# EAGLE design PRIZMA v1 (EAGLE 6.5.0)

## Sheet 1 of 3
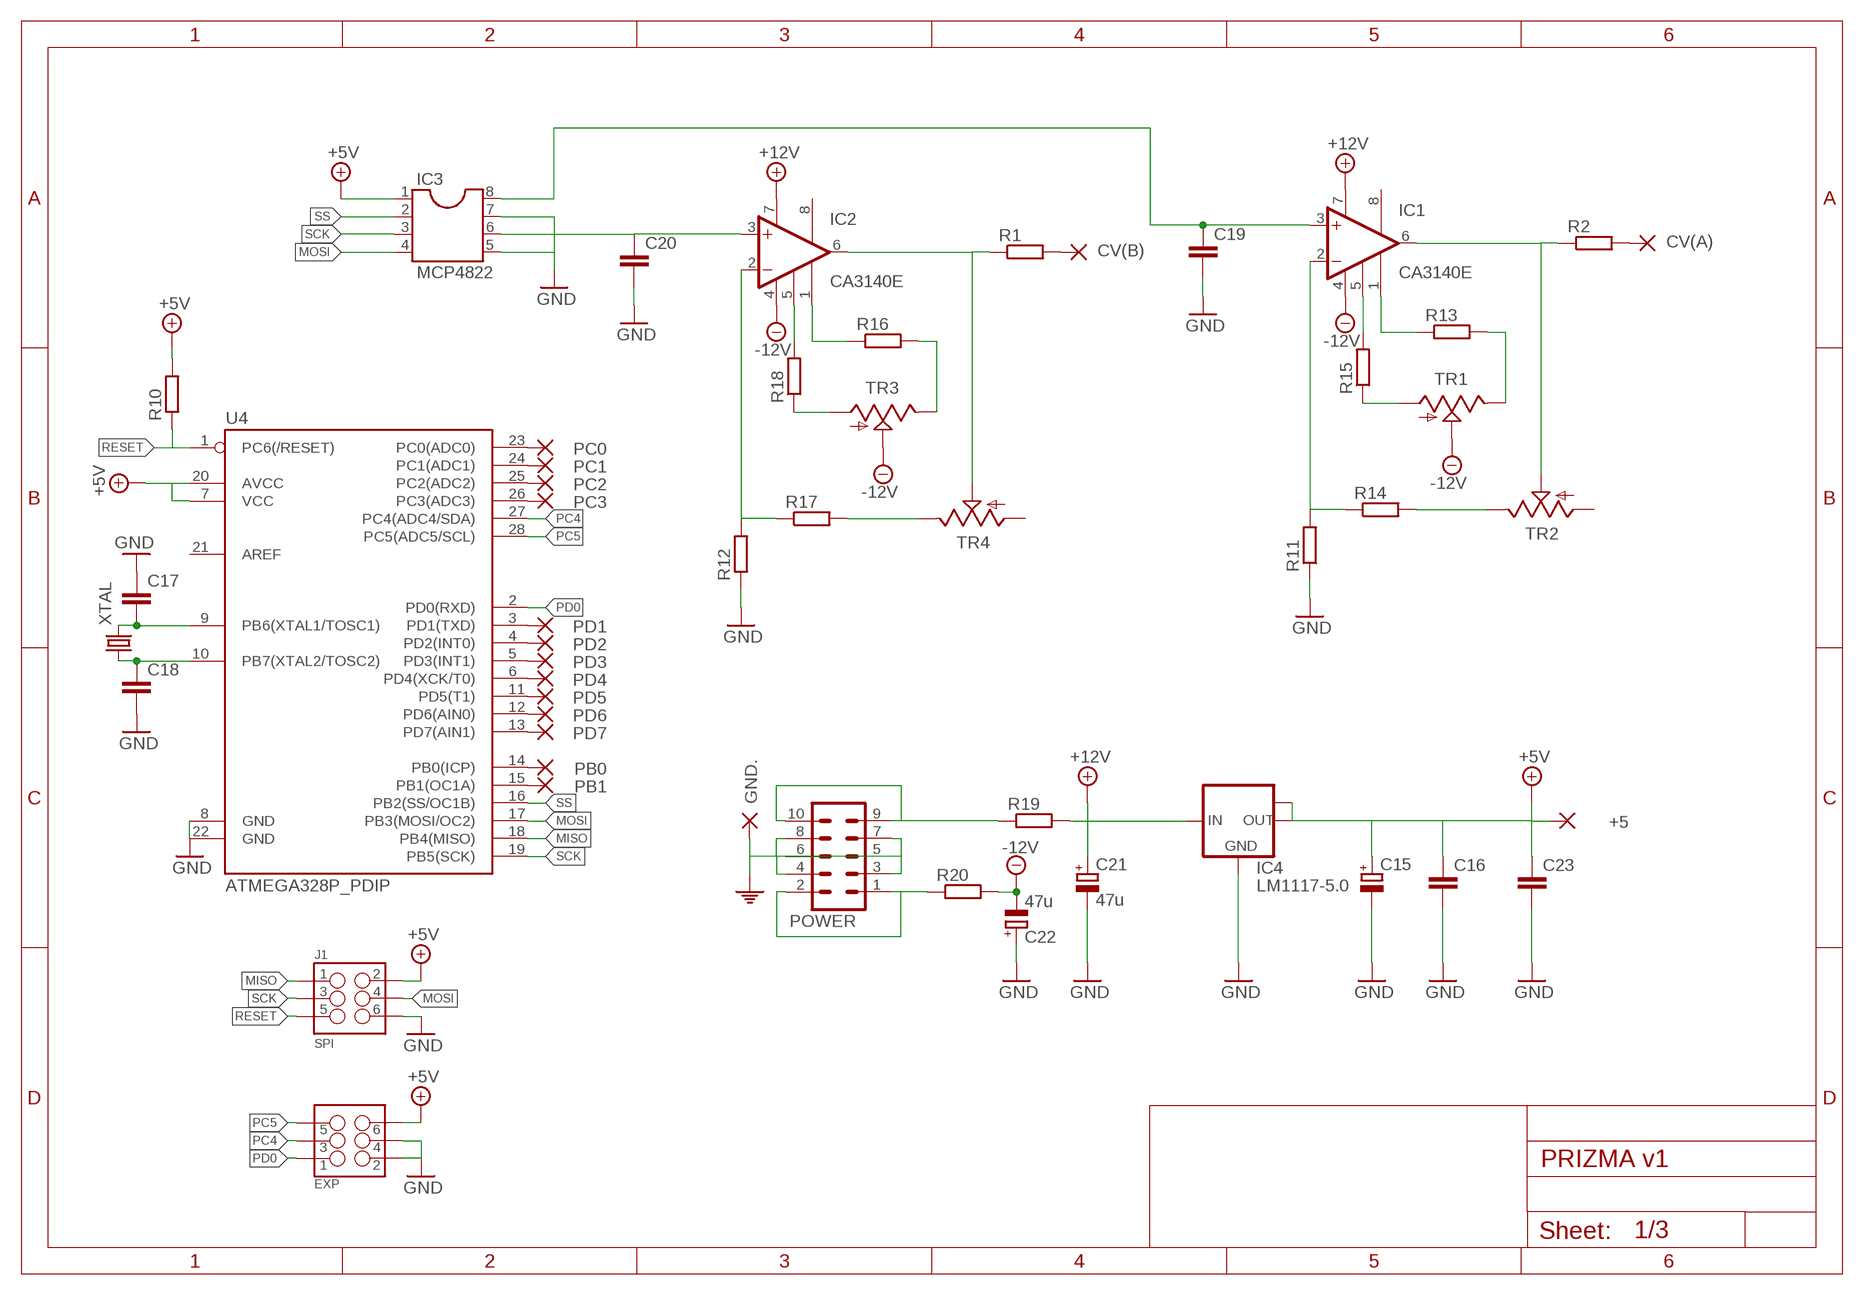
[diagram p0: schematic, sheet 1]

### Parts
+5  2,0/0,9-O  [2,0/0,9-O]
C15  CPOL-EUC  [PANASONIC_C]
C16  C-EUC0603  [C0603]
C17  C-EUC0603  [C0603]
C18  C-EUC0603  [C0603]
C19  C-EUC0603  [C0603]
C20  C-EUC0603  [C0603]
C21  47u  CPOL-EUD  [PANASONIC_D]
C22  47u  CPOL-EUD  [PANASONIC_D]
C23  C-EUC0603  [C0603]
CV(A)  2,0/0,9-O  [2,0/0,9-O]
CV(B)  2,0/0,9-R  [2,0/0,9-R]
EXP  M03X2NO_SILK  [2X3-NS]
GND.  2,0/0,9-O  [2,0/0,9-O]
IC1  CA3140E  OP97P  [DIL08]
IC2  CA3140E  OP97P  [DIL08]
IC3  MCP4822  DIL8  [DIL08]
IC4  LM1117-5.0  LM1117MPX-5.0  [SOT223]
J1  SPI  M03X2NO_SILK  [2X3-NS]
PB0  2,0/0,9-O  [2,0/0,9-O]
PB1  2,0/0,9-O  [2,0/0,9-O]
PC0  2,0/0,9-O  [2,0/0,9-O]
PC1  2,0/0,9-O  [2,0/0,9-O]
PC2  2,0/0,9-O  [2,0/0,9-O]
PC3  2,0/0,9-O  [2,0/0,9-O]
PD1  2,0/0,9-O  [2,0/0,9-O]
PD2  2,0/0,9-O  [2,0/0,9-O]
PD3  2,0/0,9-O  [2,0/0,9-O]
PD4  2,0/0,9-O  [2,0/0,9-O]
PD5  2,0/0,9-O  [2,0/0,9-O]
PD6  2,0/0,9-O  [2,0/0,9-O]
PD7  2,0/0,9-O  [2,0/0,9-O]
POWER  M05X2SHD  [2X5-SHROUDED]
R1  R-EU_R0603  [R0603]
R2  R-EU_R0603  [R0603]
R10  R-EU_R0603  [R0603]
R11  R-EU_R0603  [R0603]
R12  R-EU_R0603  [R0603]
R13  R-EU_R0603  [R0603]
R14  R-EU_R0603  [R0603]
R15  R-EU_R0603  [R0603]
R16  R-EU_R0603  [R0603]
R17  R-EU_R0603  [R0603]
R18  R-EU_R0603  [R0603]
R19  R-EU_R0603  [R0603]
R20  R-EU_R0603  [R0603]
TR1  TRIM_US-RJ9W  [RJ9W]
TR2  TRIM_US-RJ9W  [RJ9W]
TR3  TRIM_US-RJ9W  [RJ9W]
TR4  TRIM_US-RJ9W  [RJ9W]
U4  ATMEGA328P_PDIP  [DIL28-3]
XTAL  CRYSTALSMD  [HC49UP]

### Nets
+5V: +5.1(P) C15.+ C16.1 C23.1 EXP.6 IC3.1 IC4.2(OUT) IC4.TAB(OUT1) J1.2 R10.2 U4.7(VCC) U4.20(AVCC)
+12V: C21.+ IC1.7(V+) IC2.7(V+) IC4.3(IN) R19.2
-12V: C22.- IC1.4(V-) IC2.4(V-) R20.2 TR1.S TR3.S
MISO: J1.1 U4.18(PB4(MISO))
MOSI: IC3.4 J1.4 U4.17(PB3(MOSI/OC2))
N$1: IC1.5(COMP) R15.2
N$2: R15.1 TR1.A
N$3: IC1.1(BAL1) R13.1
N$4: R13.2 TR1.E
N$5: C19.1 IC1.3(+IN) IC3.8
N$6: IC1.2(-IN) R11.2 R14.1
N$7: IC1.6(OUT) R2.1 TR2.S
N$8: R14.2 TR2.E
N$9: IC2.5(COMP) R18.2
N$10: R18.1 TR3.A
N$11: IC2.1(BAL1) R16.1
N$12: R16.2 TR3.E
N$13: C20.1 IC2.3(+IN) IC3.6
N$14: IC2.2(-IN) R12.2 R17.1
N$15: IC2.6(OUT) R1.1 TR4.S
N$16: R17.2 TR4.E
N$23: PD5.1(P) U4.11(PD5(T1))
N$24: PB1.1(P) U4.15(PB1(OC1A))
N$25: C17.2 U4.9(PB6(XTAL1/TOSC1)) XTAL.2
N$26: C18.1 U4.10(PB7(XTAL2/TOSC2)) XTAL.1
N$27: PD4.1(P) U4.6(PD4(XCK/T0))
N$28: PD7.1(P) U4.13(PD7(AIN1))
N$29: PD6.1(P) U4.12(PD6(AIN0))
N$30: PB0.1(P) U4.14(PB0(ICP))
N$31: PD2.1(P) U4.4(PD2(INT0))
N$33: PD3.1(P) U4.5(PD3(INT1))
N$34: POWER.1 POWER.2 R20.1
N$46: PC0.1(P) U4.23(PC0(ADC0))
N$52: PC1.1(P) U4.24(PC1(ADC1))
N$53: PC2.1(P) U4.25(PC2(ADC2))
N$54: PC3.1(P) U4.26(PC3(ADC3))
N$55: POWER.9 POWER.10 R19.1
N$57: PD1.1(P) U4.3(PD1(TXD))
N$60: CV(A).1(P) R2.2
N$61: CV(B).1(P) R1.2
PC4: EXP.3 U4.27(PC4(ADC4/SDA))
PC5: EXP.5 U4.28(PC5(ADC5/SCL))
PD0: EXP.1 U4.2(PD0(RXD))
PE: C15.- C16.2 C17.1 C18.2 C19.2 C20.2 C21.- C22.+ C23.2 EXP.2 EXP.4 GND..1(P) IC3.5 IC3.7 IC4.1(GND) J1.6 POWER.3 POWER.4 POWER.5 POWER.6 POWER.7 POWER.8 R11.1 R12.1 U4.8(GND) U4.22(GND) ; supply symbol labelled GND
RESET: J1.5 R10.1 U4.1(PC6(/RESET))
SCK: IC3.3 J1.3 U4.19(PB5(SCK))
SS: IC3.2 U4.16(PB2(SS/OC1B))
Unconnected: IC1.8(BAL2) IC2.8(BAL2) TR2.A TR4.A U4.21(AREF)

## Sheet 2 of 3
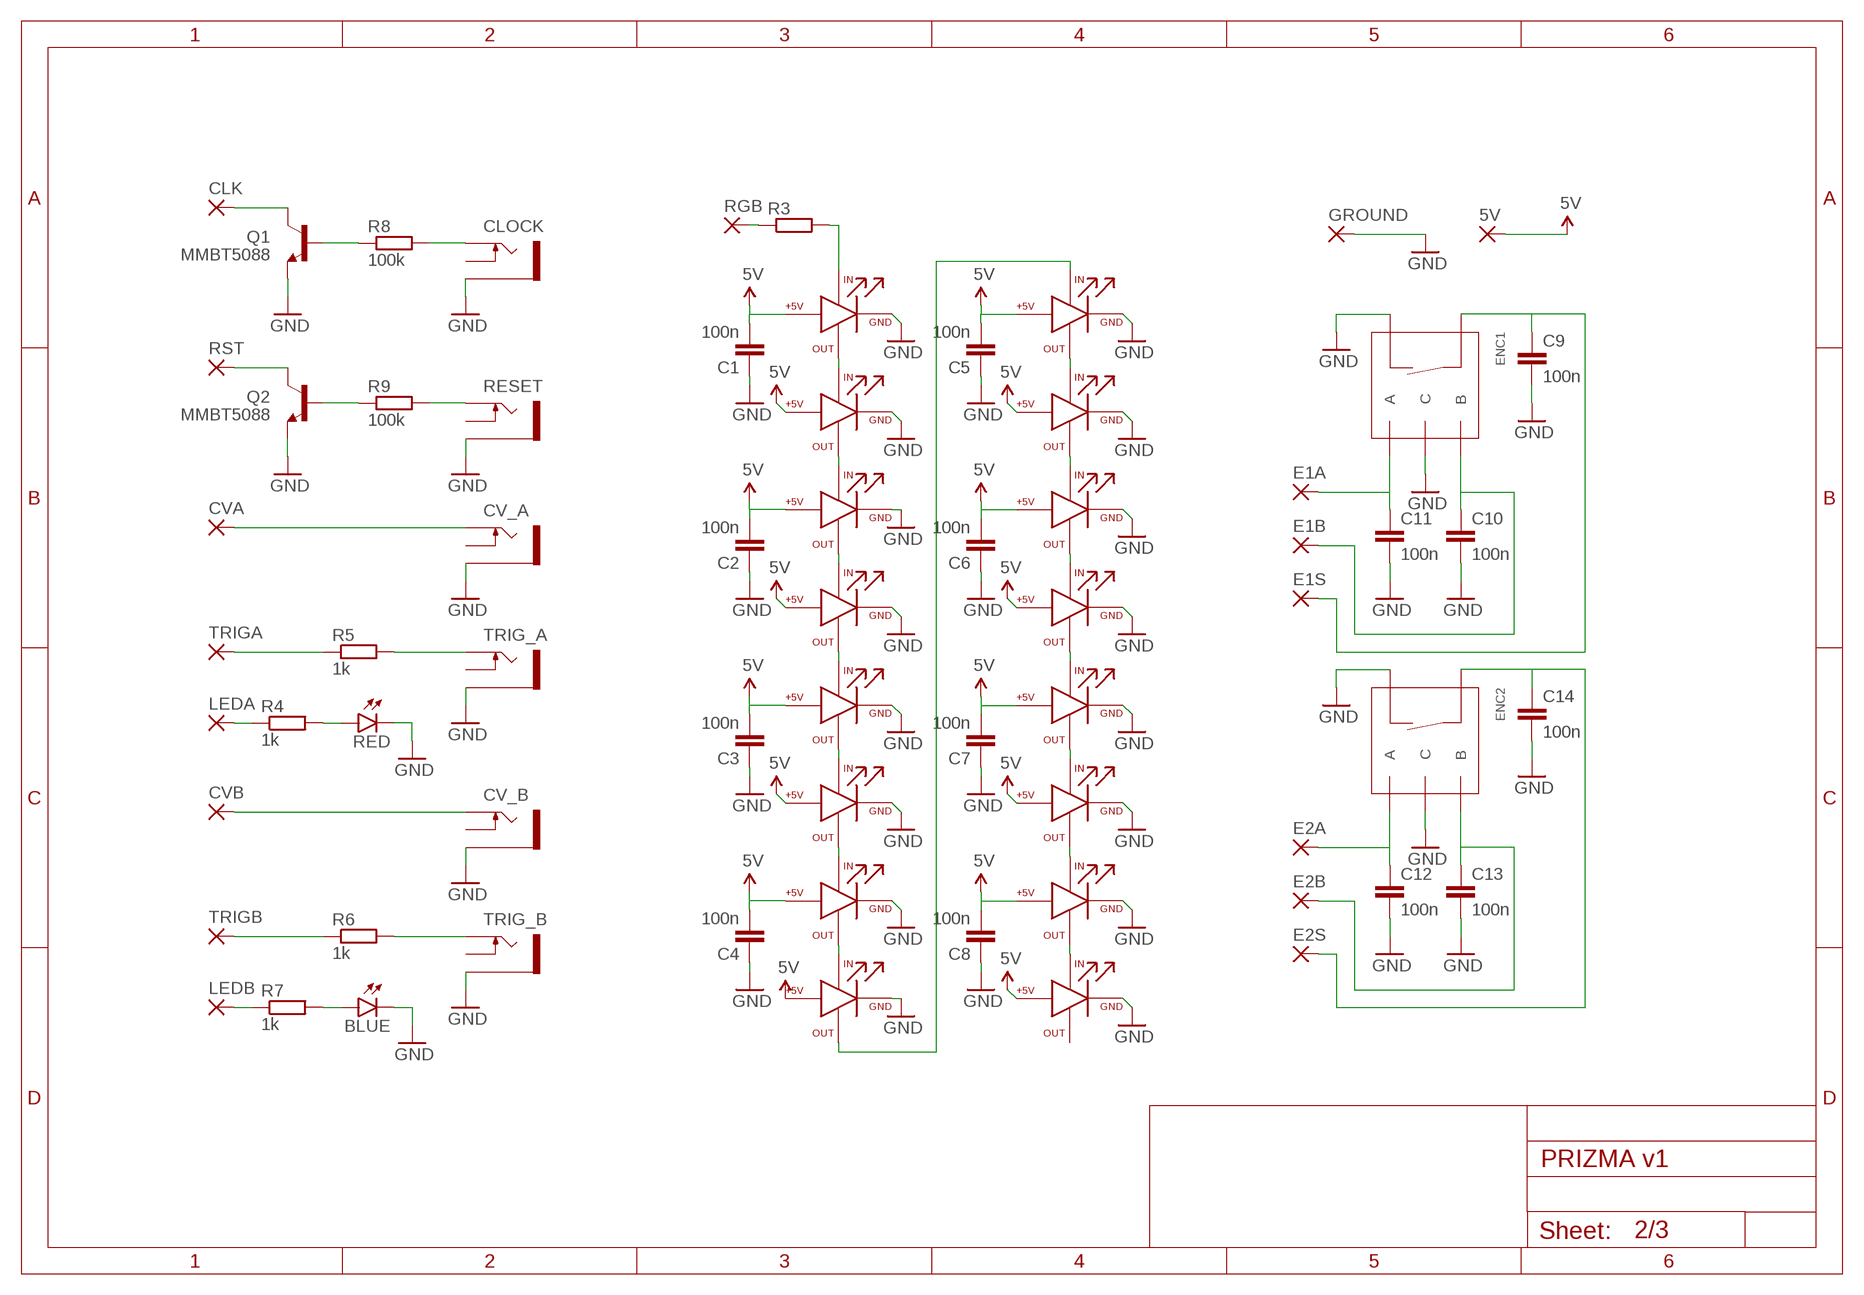
[diagram p1: schematic, sheet 2]

### Parts
5V  2,0/0,9-R  [2,0/0,9-R]
BLUE  LED3MM  [LED3MM]
C1  100n  C-EUC0603  [C0603]
C2  100n  C-EUC0603  [C0603]
C3  100n  C-EUC0603  [C0603]
C4  100n  C-EUC0603  [C0603]
C5  100n  C-EUC0603  [C0603]
C6  100n  C-EUC0603  [C0603]
C7  100n  C-EUC0603  [C0603]
C8  100n  C-EUC0603  [C0603]
C9  100n  C-EUC0603  [C0603]
C10  100n  C-EUC0603  [C0603]
C11  100n  C-EUC0603  [C0603]
C12  100n  C-EUC0603  [C0603]
C13  100n  C-EUC0603  [C0603]
C14  100n  C-EUC0603  [C0603]
CLK  2,0/0,9-O  [2,0/0,9-O]
CLOCK  THONKICONN  [THONKICONN]
CV_A  THONKICONN  [THONKICONN]
CV_B  THONKICONN  [THONKICONN]
CVA  2,0/0,9-R  [2,0/0,9-R]
CVB  2,0/0,9-R  [2,0/0,9-R]
D1  LED-RGB-CA-THRUCLEAR  [LED-RGB-THRU]
D2  LED-RGB-CA-THRUCLEAR  [LED-RGB-THRU]
D3  LED-RGB-CA-THRUCLEAR  [LED-RGB-THRU]
D4  LED-RGB-CA-THRUCLEAR  [LED-RGB-THRU]
D5  LED-RGB-CA-THRUCLEAR  [LED-RGB-THRU]
D6  LED-RGB-CA-THRUCLEAR  [LED-RGB-THRU]
D7  LED-RGB-CA-THRUCLEAR  [LED-RGB-THRU]
D8  LED-RGB-CA-THRUCLEAR  [LED-RGB-THRU]
D13  LED-RGB-CA-THRUCLEAR  [LED-RGB-THRU]
D14  LED-RGB-CA-THRUCLEAR  [LED-RGB-THRU]
D15  LED-RGB-CA-THRUCLEAR  [LED-RGB-THRU]
D19  LED-RGB-CA-THRUCLEAR  [LED-RGB-THRU]
D20  LED-RGB-CA-THRUCLEAR  [LED-RGB-THRU]
D21  LED-RGB-CA-THRUCLEAR  [LED-RGB-THRU]
D22  LED-RGB-CA-THRUCLEAR  [LED-RGB-THRU]
D23  LED-RGB-CA-THRUCLEAR  [LED-RGB-THRU]
E1A  2,0/0,9-O  [2,0/0,9-O]
E1B  2,0/0,9-O  [2,0/0,9-O]
E1S  2,0/0,9-O  [2,0/0,9-O]
E2A  2,0/0,9-O  [2,0/0,9-O]
E2B  2,0/0,9-O  [2,0/0,9-O]
E2S  2,0/0,9-O  [2,0/0,9-O]
ENC1  ROTARTY_ENCODER  [ROTARY_ENC_PLAIN]
ENC2  ROTARTY_ENCODER  [ROTARY_ENC_PLAIN]
GROUND  2,0/0,9-O  [2,0/0,9-O]
LEDA  2,0/0,9-R  [2,0/0,9-R]
LEDB  2,0/0,9-R  [2,0/0,9-R]
Q1  MMBT5088  TRANSISTOR_NPNMMBT5088  [SOT23-3]
Q2  MMBT5088  TRANSISTOR_NPNMMBT5088  [SOT23-3]
R3  R-EU_R0603  [R0603]
R4  1k  R-EU_R0603  [R0603]
R5  1k  R-EU_R0603  [R0603]
R6  1k  R-EU_R0603  [R0603]
R7  1k  R-EU_R0603  [R0603]
R8  100k  R-EU_R0603  [R0603]
R9  100k  R-EU_R0603  [R0603]
RED  LED3MM  [LED3MM]
RESET  THONKICONN  [THONKICONN]
RGB  2,0/0,9-O  [2,0/0,9-O]
RST  2,0/0,9-O  [2,0/0,9-O]
TRIG_A  THONKICONN  [THONKICONN]
TRIG_B  THONKICONN  [THONKICONN]
TRIGA  2,0/0,9-R  [2,0/0,9-R]
TRIGB  2,0/0,9-R  [2,0/0,9-R]

### Nets
5V: 5V.1(P) C1.2 C2.2 C3.2 C4.2 C5.2 C6.2 C7.2 C8.2 D1.2(+5V) D2.2(+5V) D3.2(+5V) D4.2(+5V) D5.2(+5V) D6.2(+5V) D7.2(+5V) D8.2(+5V) D13.2(+5V) D14.2(+5V) D15.2(+5V) D19.2(+5V) D20.2(+5V) D21.2(+5V) D22.2(+5V) D23.2(+5V)
GND: BLUE.K(C) C1.1 C2.1 C3.1 C4.1 C5.1 C6.1 C7.1 C8.1 C9.2 C10.2 C11.2 C12.2 C13.2 C14.2 CLOCK.P$1 CV_A.P$1 CV_B.P$1 D1.3(GND) D2.3(GND) D3.3(GND) D4.3(GND) D5.3(GND) D6.3(GND) D7.3(GND) D8.3(GND) D13.3(GND) D14.3(GND) D15.3(GND) D19.3(GND) D20.3(GND) D21.3(GND) D22.3(GND) D23.3(GND) ENC1.C ENC1.SW- ENC2.C ENC2.SW- GROUND.1(P) Q1.2(E) Q2.2(E) RED.K(C) RESET.P$1 TRIG_A.P$1 TRIG_B.P$1
N$17: C11.1 E1A.1(P) ENC1.A
N$18: C10.1 E1B.1(P) ENC1.B
N$19: C12.1 E2A.1(P) ENC2.A
N$20: C13.1 E2B.1(P) ENC2.B
N$21: C14.1 E2S.1(P) ENC2.SW+
N$22: C9.1 E1S.1(P) ENC1.SW+
N$32: D19.1(DATA_IN) R3.2
N$36: Q1.1(B) R8.1
N$37: Q2.1(B) R9.1
N$38: CLK.1(P) Q1.3(C)
N$39: Q2.3(C) RST.1(P)
N$40: CLOCK.P$3 R8.2
N$41: R9.2 RESET.P$3
N$42: CV_A.P$3 CVA.1(P)
N$43: R5.1 TRIGA.1(P)
N$44: CV_B.P$3 CVB.1(P)
N$45: R5.2 TRIG_A.P$3
N$47: D19.4(DATA_OUT) D20.1(DATA_IN)
N$48: R4.2 RED.A
N$49: BLUE.A R7.2
N$50: LEDB.1(P) R7.1
N$51: LEDA.1(P) R4.1
N$58: D20.4(DATA_OUT) D21.1(DATA_IN)
N$64: R3.1 RGB.1(P)
N$66: D21.4(DATA_OUT) D22.1(DATA_IN)
N$67: R6.1 TRIGB.1(P)
N$68: D22.4(DATA_OUT) D23.1(DATA_IN)
N$69: R6.2 TRIG_B.P$3
N$70: D13.1(DATA_IN) D23.4(DATA_OUT)
N$71: D13.4(DATA_OUT) D14.1(DATA_IN)
N$72: D14.4(DATA_OUT) D15.1(DATA_IN)
N$73: D1.4(DATA_OUT) D2.1(DATA_IN)
N$74: D2.4(DATA_OUT) D3.1(DATA_IN)
N$75: D3.4(DATA_OUT) D4.1(DATA_IN)
N$76: D4.4(DATA_OUT) D5.1(DATA_IN)
N$77: D5.4(DATA_OUT) D6.1(DATA_IN)
N$78: D6.4(DATA_OUT) D7.1(DATA_IN)
N$79: D7.4(DATA_OUT) D8.1(DATA_IN)
N$80: D1.1(DATA_IN) D15.4(DATA_OUT)
Unconnected: CLOCK.P$2 CV_A.P$2 CV_B.P$2 D8.4(DATA_OUT) RESET.P$2 TRIG_A.P$2 TRIG_B.P$2

## Sheet 3 of 3
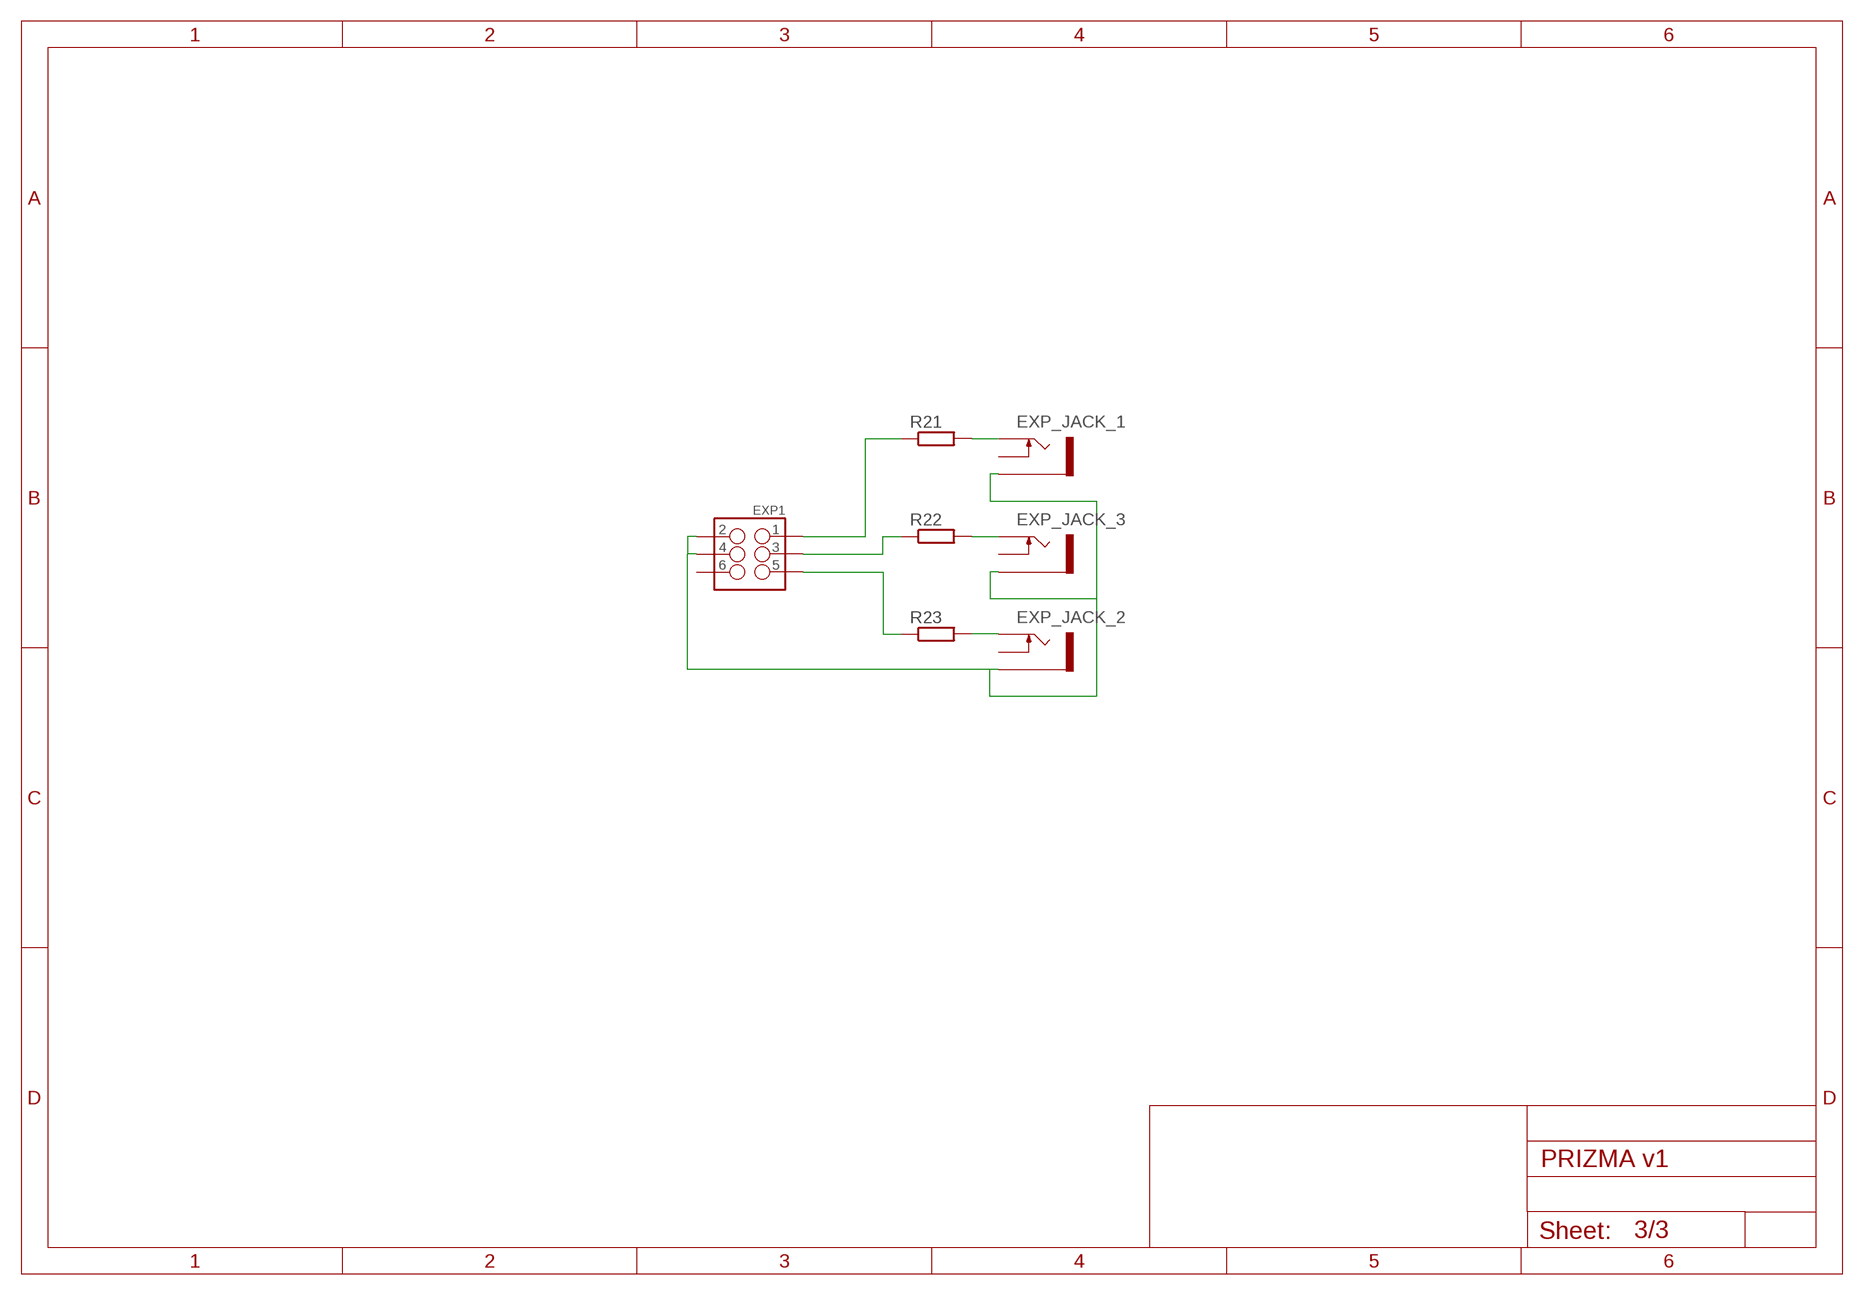
[diagram p2: schematic, sheet 3]

### Parts
EXP1  M03X2NO_SILK  [2X3-NS]
EXP_JACK_1  THONKICONN  [THONKICONN]
EXP_JACK_2  THONKICONN  [THONKICONN]
EXP_JACK_3  THONKICONN  [THONKICONN]
R21  R-EU_R0603  [R0603]
R22  R-EU_R0603  [R0603]
R23  R-EU_R0603  [R0603]

### Nets
N$56: EXP1.2 EXP1.4 EXP_JACK_1.P$1 EXP_JACK_2.P$1 EXP_JACK_3.P$1
N$59: EXP1.5 R23.1
N$62: EXP1.3 R22.1
N$63: EXP1.1 R21.1
N$65: EXP_JACK_3.P$3 R22.2
N$81: EXP_JACK_2.P$3 R23.2
N$82: EXP_JACK_1.P$3 R21.2
Unconnected: EXP1.6 EXP_JACK_1.P$2 EXP_JACK_2.P$2 EXP_JACK_3.P$2

## Library data of the parts
5V CV(B) CVA CVB LEDA LEDB TRIGA TRIGB = synthdiy updated imperial:2,0/0,9-R: ROUND THROUGH-HOLE PAD 2.0 mm, 0.9 mm/0.079",0.035"
+5 CLK CV(A) E1A E1B E1S E2A E2B E2S GND. GROUND PB0 PB1 PC0 PC1-PC3 PD1-PD7 RGB RST = synthdiy updated imperial:2,0/0,9-O: OCT THROUGH-HOLE PAD 2.0 mm, 0.9 mm/0.079",0.035"
BLUE RED = SparkFun-LED:LED: LEDs Standard schematic elements and footprints for 5mm, 3mm, 1206, and 0603 sized LEDs. 5mm - Spark Fun Electronics SKU : COM-00529 (and others); PROD_ID: DIO-08794
C1-C14 C16-C20 C23 = resistor:C-EU: CAPACITOR, European symbol
C15 C21 C22 = resistor:CPOL-EU: POLARIZED CAPACITOR, European symbol
CLOCK CV_A CV_B EXP_JACK_1-EXP_JACK_3 RESET TRIG_A TRIG_B = thonkiconn:THONKICONN
D1-D8 D13-D15 D19-D23 = WS2812:LED-RGB-CA-THRU: RGB Through-hole common anode SparkFun store front COM-10821 (diffuse) COM-10820 (clear); PROD_ID: DIO-10631
ENC1 ENC2 = SparkFun-Electromechanical:ROTARTY_ENCODER: Simple no LED rotary encoder Example: COM-09117
EXP EXP1 J1 = SparkFun-Connectors:M03X2: 2x3 .1" header. Shrouded, with keying- CONN-10681 SMT- CONN-11415 Pogo pins- HW-11044
IC1 IC2 = linear:OP97: Low Power, High Precision Operational Amplifier Source: http://www.analog.com/static/imported-files/data_sheets/OP97.pdf
IC3 = ic-package:DIL8: Dual In Line / Socket
IC4 = lm1117:LM1117MPX-*
POWER = SparkFun-Connectors:M05X2: Header 5x2 Standard 10-pin dual row 0.1" header. Commonly used with AVR-ISP. Use with Spark Fun Electronics SKU: PRT-00778
Q1 Q2 = SparkFun-DiscreteSemi:TRANSISTOR_NPN: Generic NPN BJT MMBT2222A - TRANS-08049 (SOT-23, 1A 40V) MPSA42 - TRANS-09116 (SOT-23, 500mA 300V) MMBT5088LT1G - TRANS-11160 (SOT-23, 50 mA 30V) BC547 - COM-08928 <http://www.sparkfun.com/products/8928> (TO-92 45V 100mA) (1.Collector 2.Base 3.Emitter) 2N3904 - COM-00521 <http://www.sparkfun.com/products/521> (TO-92 40V 200mA) (1.Emitter 2.Base 3.Collector) P2N2222A - COM-12852 <http://www.sparkfun.com/products/12852> (TO-92 40V 600mA) (1.Collector 2.Base 3.Emitter); PROD_ID: TRANS-11160
R1-R23 = resistor:R-EU_: RESISTOR, European symbol
TR1-TR4 = pot:TRIM_US-: POTENTIOMETER
U4 = SparkFun-DigitalIC:ATMEGA328P_PDIP: uC used in the Arduino 32kb flash, 1k EEPROM, 2k SRAM This is the through-hole version of this chip.
XTAL = SparkFun-FreqCtrl:CRYSTAL: Various standard crystals. Proven footprints.

## Board
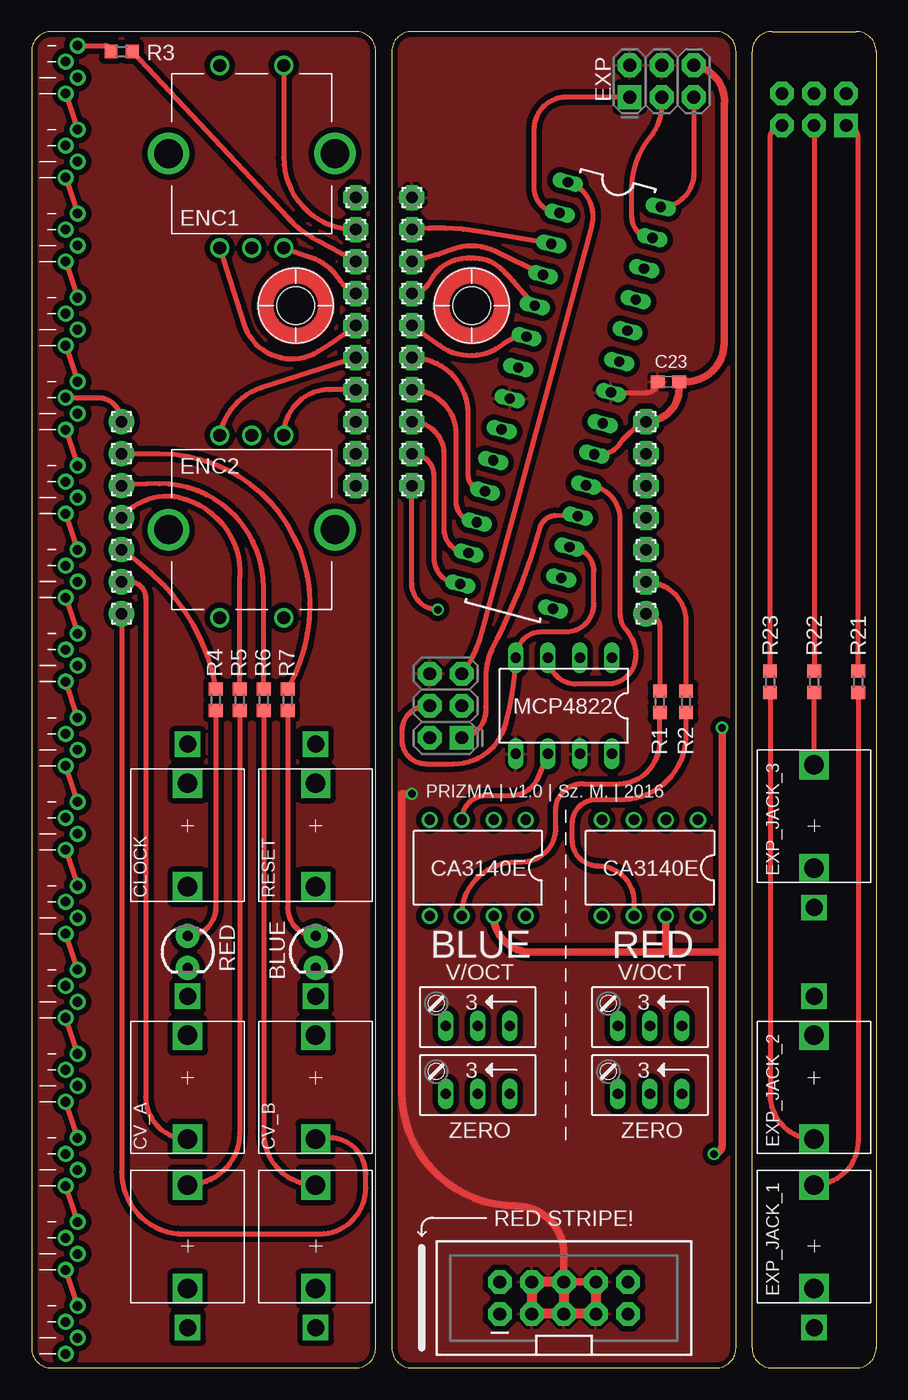
[diagram p3: board, top side]
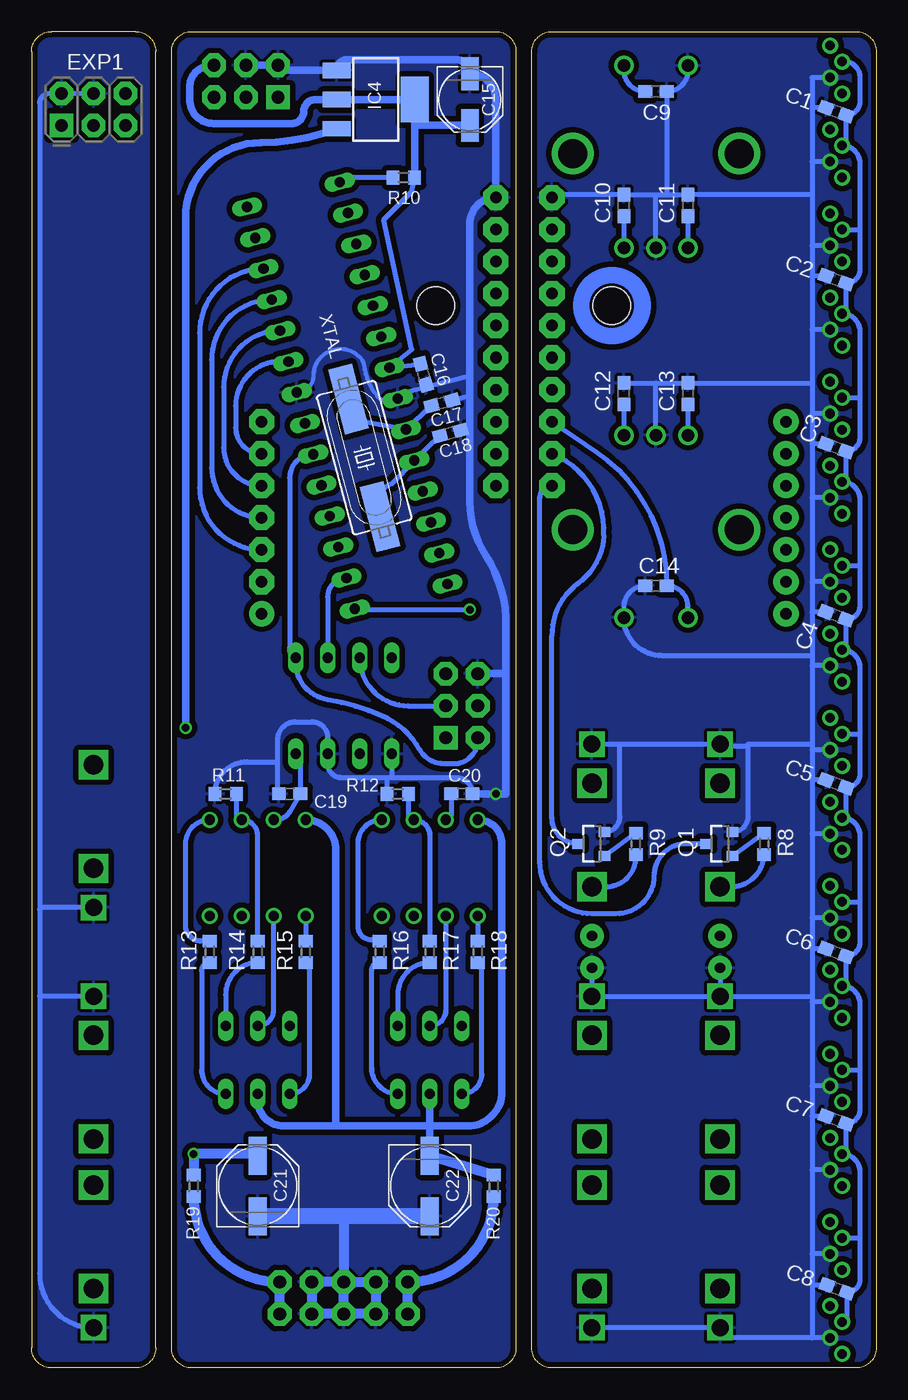
[diagram p4: board, bottom side, seen from below]

Size 66.99 x 106.05 mm. Coordinates in mm from the lower left corner, seen from the top.
Outline: 1.59,0 25.72,0 arc90 27.3,1.59 27.3,104.46 arc90 25.72,106.05 1.59,106.05 arc90 0,104.46 0,1.59 arc90 1.59,0
Outline: 30.16,0 54.29,0 arc90 55.88,1.59 55.88,104.46 arc90 54.29,106.05 30.16,106.05 arc90 28.57,104.46 28.57,1.59 arc90 30.16,0
Outline: 65.41,0 arc90 66.99,1.59 66.99,104.46 arc90 65.41,106.05 58.74,106.05 arc90 57.15,104.46 57.15,1.59 arc90 58.74,0 65.41,0
Copper layers (1*16): Top 0.0356mm / dielectric 1.5011mm / Bottom 0.0356mm
Design rules "LaenPCBOrder": minimum track width 6mil, minimum drill 13mil, track to track 6mil, track to pad 6mil, pad to pad 6mil, via to via 6mil, smd to smd 6mil, copper to edge 15mil, drill to drill 6mil, minimum pad ring 7mil, minimum via ring 7mil, stop-mask expansion 3mil, vias tented up to drill 0mil, thermal gap 10mil
Holes 3 mm at 34.92,84.3 20.95,84.3

### Footprints (pad centres in the part's own frame; a part is rotated, then mirrored left to right if it is on the bottom)
2,0/0,9-R = drill 0.914 pad 2: 1 0,0
2,0/0,9-O = drill 0.914 pad 2 octagon: 1 0,0
LED3MM = drill 0.813 pad 1.88: A -1.27,0; K 1.27,0
C0603 = smd 1.1 x 1: 1 -0.85,0; 2 0.85,0
PANASONIC_C = smd 2.6 x 1.4: + 2.05,0; - -2.05,0
PANASONIC_D = smd 3 x 1.4: + 2.4,0; - -2.4,0
THONKICONN = drill 1.35 square: P$1 0,-6.48 | drill 1.55 square: P$2 0,-3.38; P$3 0,4.84
LED-RGB-THRU = drill 0.762 pad 1.27: 1 1.905,-0.476; 2 0.635,0.476; 3 -0.635,-0.476; 4 -1.905,0.476
ROTARY_ENC_PLAIN = drill 1.016: A 7.493,-2.54; B 7.493,2.54; C 7.493,0; SW+ -6.985,2.54; SW- -6.985,-2.54 | drill 2.286: P$3 0,6.604; P$4 0,-6.604
2X3-NS = drill 1.016 pad 1.88 square: 1 -2.54,-1.27 | drill 1.016 pad 1.88 octagon: 2 -2.54,1.27; 3 0,-1.27; 4 0,1.27; 5 2.54,-1.27; 6 2.54,1.27
DIL08 = drill 0.813 pad 1.27: 1 -3.81,-3.81; 2 -1.27,-3.81; 3 1.27,-3.81; 4 3.81,-3.81; 5 3.81,3.81; 6 1.27,3.81; 7 -1.27,3.81; 8 -3.81,3.81
DIL08' = drill 0.813 long: 1 -3.81,-3.81; 2 -1.27,-3.81; 3 1.27,-3.81; 4 3.81,-3.81; 5 3.81,3.81; 6 1.27,3.81; 7 -1.27,3.81; 8 -3.81,3.81
SOT223 = smd 1.219 x 2.235: 1 -2.311,-3.099; 2 0,-3.099; 3 2.311,-3.099 | smd 3.6 x 2.2: TAB 0,3.099
2X5-SHROUDED = drill 1.016 pad 1.88 octagon: 1 -1.27,5.08; 2 1.27,5.08; 3 -1.27,2.54; 4 1.27,2.54; 5 -1.27,0; 6 1.27,0; 7 -1.27,-2.54; 8 1.27,-2.54; 9 -1.27,-5.08; 10 1.27,-5.08
SOT23-3 = smd 0.8 x 0.9: 1 -0.95,-1; 2 0.95,-1; 3 0,1.1
R0603 = smd 1 x 1.1: 1 -0.85,0; 2 0.85,0
RJ9W = drill 0.813 long: A 2.54,0.635; E -2.54,0.635; S 0,0.635
DIL28-3 = drill 0.813 long: 1 -16.51,-3.81; 2 -13.97,-3.81; 3 -11.43,-3.81; 4 -8.89,-3.81; 5 -6.35,-3.81; 6 -3.81,-3.81; 7 -1.27,-3.81; 8 1.27,-3.81; 9 3.81,-3.81; 10 6.35,-3.81; 11 8.89,-3.81; 12 11.43,-3.81; 13 13.97,-3.81; 14 16.51,-3.81; 15 16.51,3.81; 16 13.97,3.81; 17 11.43,3.81; 18 8.89,3.81; 19 6.35,3.81; 20 3.81,3.81; 21 1.27,3.81; 22 -1.27,3.81; 23 -3.81,3.81; 24 -6.35,3.81; 25 -8.89,3.81; 26 -11.43,3.81; 27 -13.97,3.81; 28 -16.51,3.81
HC49UP = smd 5.334 x 1.93: 1 -4.826,0; 2 4.826,0

### Placement (x,y rotation side)
5V  7.14,75.09 0 top
+5  48.74,75.09 180 top
BLUE  22.54,33.02 270 top
C1  3.17,99.69 340 bottom
C2  3.17,86.36 340 bottom
C3  3.17,73.03 340 bottom
C4  3.17,59.69 340 bottom
C5  3.17,46.35 340 bottom
C6  3.18,32.97 340 bottom
C7  3.17,19.68 340 bottom
C8  3.1,6.29 340 bottom
C9  17.46,101.28 0 bottom
C10  20,92.23 90 bottom
C11  14.92,92.23 90 bottom
C12  20,77.31 90 bottom
C13  14.92,77.31 90 bottom
C14  17.46,62.07 180 bottom
C15  32.23,100.65 270 bottom
C16  35.91,78.85 285 bottom
C17  34.44,76.57 195 bottom
C18  33.77,74.18 15 bottom
C19  46.51,45.56 180 bottom
C20  32.86,45.56 0 bottom
C21  49.05,14.45 90 bottom
C22  35.4,14.45 270 bottom
C23  50.51,78.25 180 top
CLK  25.72,70.01 0 top
CLOCK  12.38,43.02 180 top
CV(A)  48.74,62.39 0 top
CV(B)  48.74,59.85 0 top
CV_A  12.38,23.02 180 top
CV_B  22.54,23.02 180 top
CVA  7.14,62.39 0 top
CVB  7.14,59.85 0 top
D1  3.17,49.69 90 top
D2  3.17,43.02 90 top
D3  3.17,36.35 90 top
D4  3.17,29.69 90 top
D5  3.17,23.02 90 top
D6  3.17,16.35 90 top
D7  3.17,9.68 90 top
D8  3.17,3.02 90 top
D13  3.17,69.69 90 top
D14  3.17,63.02 90 top
D15  3.17,56.36 90 top
D19  3.17,103.03 90 top
D20  3.17,96.36 90 top
D21  3.17,89.69 90 top
D22  3.17,83.03 90 top
D23  3.17,76.36 90 top
E1A  25.72,82.71 90 top
E1B  25.72,85.25 90 top
E1S  25.72,90.33 90 top
E2A  25.72,77.63 90 top
E2B  25.72,80.17 90 top
E2S  25.72,75.09 90 top
ENC1  17.46,96.36 270 top
ENC2  17.46,66.52 90 top
EXP  49.98,102.11 0 top
EXP1  62.07,99.85 0 bottom
EXP_JACK_1  62.07,9.68 0 top
EXP_JACK_2  62.07,23.02 180 top
EXP_JACK_3  62.07,43.02 0 top
GND.  30.16,92.87 0 top
GROUND  25.72,92.87 0 top
IC1  49.05,39.69 180 top
IC2  35.4,39.69 180 top
IC3  MCP4822  [DIL08']  42.23,52.55 180 top
IC4  39.69,100.65 270 bottom
J1  32.86,52.55 90 top
LEDA  7.14,64.93 0 top
LEDB  7.14,72.55 0 top
PB0  30.16,72.55 0 top
PB1  30.16,70.01 180 top
PC0  48.74,72.55 90 top
PC1  48.74,70.01 270 top
PC2  48.74,67.47 270 top
PC3  48.74,64.93 270 top
PD1  30.16,90.33 180 top
PD2  30.16,87.79 0 top
PD3  30.16,85.25 0 top
PD4  30.16,82.71 0 top
PD5  30.16,80.17 0 top
PD6  30.16,77.63 0 top
PD7  30.16,75.09 0 top
POWER  42.23,5.56 90 top
Q1  12.38,41.59 90 bottom
Q2  22.54,41.59 90 bottom
R1  49.85,52.86 90 top
R2  51.91,52.86 90 top
R3  7.14,104.46 180 top
R4  14.61,53.02 270 top
R5  16.51,53.02 270 top
R6  18.41,53.02 270 top
R7  20.32,53.02 270 top
R8  8.89,41.59 270 bottom
R9  19.05,41.59 270 bottom
R10  37.47,94.46 0 bottom
R11  51.59,45.56 0 bottom
R12  37.94,45.56 0 bottom
R13  52.86,33.02 270 bottom
R14  49.05,33.02 270 bottom
R15  45.24,33.02 90 bottom
R16  39.37,33.02 270 bottom
R17  35.4,33.02 270 bottom
R18  31.59,33.02 90 bottom
R19  54.13,14.45 90 bottom
R20  30.32,14.45 90 bottom
R21  65.56,54.45 270 top
R22  62.07,54.45 270 top
R23  58.58,54.45 270 top
RED  12.38,33.02 270 top
RESET  22.54,43.02 180 top
RGB  25.72,87.79 0 top
RST  25.72,72.55 0 top
TR1  49.05,22.38 180 top
TR2  49.05,27.78 180 top
TR3  35.4,22.38 180 top
TR4  35.4,27.78 180 top
TRIG_A  12.38,9.68 0 top
TRIG_B  22.54,9.68 0 top
TRIGA  7.14,67.47 0 top
TRIGB  7.14,70.01 0 top
U4  41.95,77.17 255 top
XTAL  40.6,72.23 105 bottom

### Tracks (layer width: path | path; a pad name or v marks a point on that pad's centre or on a via)
5V
  Top 0.406: D23.2 5.24,76.99 arc-90 5V.1
  Bottom 0.406: D8.2 arc-90 2.3,4.05 C8.2 arc-90 1.27,7.03 1.27,10.32 | 1.27,10.32 1.27,15.56 arc-90 D6.2 arc-90 2.38,17.31 C7.2 arc-90 1.27,20.5 1.27,23.65 | 1.27,23.65 1.27,28.89 arc-90 D4.2 arc-90 2.39,30.63 C6.2 arc-90 1.27,33.79 1.27,36.99 | 1.27,36.99 1.27,42.23 arc-90 D2.2 arc-90 2.38,43.98 C5.2 arc-90 1.27,47.17 1.27,50.32 | 1.27,50.32 1.27,55.56 arc-90 D15.2 arc-90 2.38,57.31 C4.2 arc-90 1.27,60.51 1.27,63.66 | 1.27,63.66 1.27,68.9 arc-90 D13.2 arc-90 2.38,70.65 C3.2 arc-90 1.27,73.84 1.27,76.99 | 1.27,76.99 1.27,82.23 arc-90 D22.2 arc-90 2.38,83.98 C2.2 arc-90 1.27,87.18 1.27,90.33 | 1.27,90.33 1.27,95.57 arc-90 D20.2 arc-90 2.38,97.32 C1.2 arc-90 1.27,100.51 1.27,102.39 arc-90 2.54,103.66 D19.2 | D21.2 1.27,90.33 | D23.2 1.27,76.99 | D14.2 1.27,63.66 | D1.2 1.27,50.32 | D3.2 1.27,36.99 | D5.2 1.27,23.65 | D7.2 1.27,10.32
+5V
  Top 0.406: U4.20 arc66 46.67,73.34 arc-30 +5.1
  Top 0.61: EXP.6 arc-90 54.93,100.02 54.93,81.28 arc-90 51.9,78.25 C23.1 51.37,77.72 arc-90 +5.1
  Bottom 0.406: 36.75,94.59 R10.2 36.83,93.34 39.05,91.12 36.83,80.8 U4.7 C16.1 arc90 36.23,79.38 | U4.20 arc-90 46.51,70.63 46.51,57.15 arc-90 IC3.1 arc-86 43.5,53.02 arc13 39.21,51.75 arc37 36.2,49.05 arc-61 34.29,47.94 33.34,47.94 arc-90 J1.2
  Bottom 0.61: EXP.6 52.67,103.38 arc-90 54.45,101.6 54.45,100.65 arc-90 52.55,98.74 46.35,98.74 arc-90 45.4,99.69 arc90 44.45,100.65 IC4.2 IC4.TAB 36.59,98.74 | C15.+ 36.44,98.6 arc90 36.59,98.74 | 36.59,98.74 36.59,94.46 R10.2
+12V  (via drill 0.6)
  Top 0.61: 54.77,33.02 54.77,17.62 arc-90 v54.13,16.99 | IC2.7 arc90 39.53,33.02 50.32,33.02 | 50.32,33.02 54.77,33.02 | IC1.7 50.32,33.02 | v54.77,50.8 54.77,33.02
  Bottom 0.61: v54.77,50.8 54.77,91.28 arc90 48.83,97.22 arc-21 IC4.3
  Bottom 0.813: C21.+ arc-90 49.19,16.99 v54.13,16.99 R19.2
-12V
  Bottom 0.61: IC2.4 arc90 29.69,41.59 29.69,21.91 arc90 32.38,19.21 35.4,19.21 | 35.4,19.21 35.72,19.21 | TR3.S 35.4,19.53 arc90 35.72,19.21 | 35.72,19.21 42.86,19.21 | 42.86,19.21 46.99,19.21 arc90 49.05,21.27 TR1.S | C22.- 35.4,19.21 | IC1.4 arc90 42.86,41.12 42.86,19.21
  Bottom 0.813: R20.2 C22.-
GND
  Bottom 0.406: 5.08,2.38 11.56,2.38 TRIG_A.P$1 TRIG_B.P$1 | 5.08,99.99 5.08,102.39 D19.3 | 5.08,99.99 5.08,95.73 | 5.08,95.73 5.08,93.08 | 5.08,93.08 5.08,89.06 | 5.08,89.06 5.08,86.65 | 5.08,86.65 5.08,82.39 | 5.08,82.39 5.08,78.16 | 5.08,78.16 5.08,75.72 | 5.08,75.72 5.08,73.32 | 5.08,73.32 5.08,69.06 | 5.08,69.06 5.08,62.39 | 5.08,62.39 5.08,59.98 | 5.08,59.98 5.08,56.52 | 5.08,56.52 5.08,55.72 | 5.08,55.72 5.08,49.5 | 5.08,49.5 5.08,49.05 | 5.08,49.05 5.08,46.65 | 5.08,46.65 5.08,42.39 | 5.08,42.39 5.08,35.72 | 5.08,35.72 5.08,33.26 | 5.08,33.26 5.08,29.5 | 5.08,29.05 5.08,29.37 5.08,29.5 | 5.08,29.05 5.08,22.38 | 5.08,22.38 5.08,19.98 | 5.08,19.98 5.08,15.72 | 5.08,15.72 5.08,9.05 | 5.08,9.05 5.08,6.58 | 5.08,6.58 5.08,2.38 | 5.08,49.5 10.16,49.5 10.16,49.37 | 10.16,49.37 10.16,43.77 arc90 Q1.2 | 5.08,56.52 16.99,56.52 arc90 ENC2.SW- | 14.92,102.97 arc90 C9.2 16.61,93.14 arc90 16.67,93.08 | 17.46,93.08 C10.2 25.5,93.08 GROUND.1 | 17.46,93.08 16.67,93.08 | 16.67,93.08 C11.2 5.08,93.08 | 20,60.38 arc90 C14.2 | C12.2 17.46,78.16 | 17.46,78.16 C13.2 5.08,78.16 | RESET.P$1 20.32,49.5 | 20.32,49.5 CLOCK.P$1 arc-90 12.25,49.37 10.16,49.37 | Q2.2 arc-90 20.32,43.77 20.32,49.5 | C1.1 5.08,99.99 | D20.3 5.08,95.73 | D21.3 5.08,89.06 | C2.1 5.08,86.65 | D22.3 5.08,82.39 | D23.3 5.08,75.72 | C3.1 5.08,73.32 | D13.3 5.08,69.06 | D14.3 5.08,62.39 | C4.1 5.08,59.98 | D15.3 5.08,55.72 | D1.3 5.08,49.05 | C5.1 5.08,46.65 | D2.3 5.08,42.39 | D3.3 5.08,35.72 | D4.3 5.08,29.05 | D5.3 5.08,22.38 | C7.1 5.08,19.98 | D6.3 5.08,15.72 | D7.3 5.08,9.05 | C8.1 5.08,6.58 | D8.3 5.08,2.38 | C6.1 5.08,33.26 | ENC1.C 17.46,93.08 | ENC2.C 17.46,78.16 | BLUE.K CV_B.P$1 CV_A.P$1 | RED.K CV_A.P$1 | CV_A.P$1 5.08,29.5
  pour Bottom (isolate 0.432): 2.7,105.89 25.72,105.89 arc-90 27.15,104.46 27.15,1.59 arc-90 25.72,0.16 1.59,0.16 arc-90 0.16,1.59 0.16,104.46 arc-90 1.59,105.89
MISO
  Top 0.406: J1.1 arc90 36.04,52.55 arc3 36.04,54.77 arc-27 36.51,56.99 arc1 37.78,59.69 arc10 40.32,66.67 arc-76 41.59,67.63 U4.18
MOSI
  Top 0.406: U4.17 arc-90 44.61,63.2 44.61,60.64 arc-90 42.39,58.42 40.48,58.42 arc90 IC3.4 arc-12 37.62,51.12 arc-75 33.5,47.94 31.27,47.94 arc-90 29.37,49.85 29.37,50.64 arc-90 J1.4
N$1
  Bottom 0.406: IC1.5 R15.2
N$2
  Bottom 0.406: TR1.A arc-90 44.93,23.34 44.93,31.75 arc90 45.24,32.07 R15.1
N$3
  Bottom 0.406: R13.1 53.55,33.87 arc90 54.77,35.08 54.77,41.59 arc90 IC1.1
N$4
  Bottom 0.406: R13.2 arc-90 53.5,31.54 53.5,23.65 arc-90 TR1.E
N$5
  Bottom 0.406: IC1.3 arc-65 46.51,44.13 C19.1 45.66,48.68 arc-90 IC3.8
N$6
  Bottom 0.406: R14.1 49.05,42.23 arc-90 IC1.2 arc90 50.74,43.92 R11.2
N$7
  Top 0.406: R2.1 51.91,50.48 arc-90 46.99,45.09 44.77,45.09 arc90 42.86,43.18 42.86,41.91 arc90 44.93,39.85 arc-90 47.78,36.99 IC1.6
  Bottom 0.406: TR2.S arc-90 47.78,28.42 IC1.6
N$8
  Bottom 0.406: R14.2 arc-90 51.59,29.63 TR2.E
N$9
  Bottom 0.406: IC2.5 R18.2
N$10
  Bottom 0.406: TR3.A arc-90 31.27,23.34 31.27,31.75 arc90 31.59,32.07 R18.1
N$11
  Bottom 0.406: IC2.1 arc-90 41.12,41.59 41.12,35.08 arc-90 40.01,33.97 39.47,33.97 arc90 R16.1
N$12
  Bottom 0.406: TR3.E arc90 40.01,23.81 40.01,31.59 arc90 39.43,32.17 R16.2
N$13
  Top 0.406: IC3.6 40.16,46.83 arc-69 37.94,45.4 36.04,45.4 arc90 IC2.3
  Bottom 0.406: C20.1 33.71,43.92 arc90 IC2.3
N$14
  Bottom 0.406: R17.1 35.4,42.23 arc-90 IC2.2 arc90 37.09,43.92 R12.2
N$15
  Top 0.406: IC2.6 arc-90 38.42,40.16 38.89,40.16 arc90 41.59,42.86 41.59,44.45 arc-90 43.81,46.35 46.67,46.35 arc90 49.85,49.85 R1.1
  Bottom 0.406: IC2.6 34.13,28.42 arc90 TR4.S
N$16
  Bottom 0.406: R17.2 arc-90 37.94,29.63 TR4.E
N$17
  Top 0.406: ENC1.A 16.83,82.87 arc103 22.7,80.64 arc7 E1A.1
  Bottom 0.406: C11.1 ENC1.A
N$18
  Top 0.406: ENC1.B 22.23,88.11 arc-37 24.29,86.52 arc29 E1B.1
  Bottom 0.406: C10.1 ENC1.B
N$19
  Top 0.406: E2A.1 23.62,77.63 arc90 ENC2.A
  Bottom 0.406: C12.1 ENC2.A
N$20
  Top 0.406: E2B.1 18.26,77.79 arc62 ENC2.B
  Bottom 0.406: C13.1 ENC2.B
N$21
  Bottom 0.406: E2S.1 22.23,72.71 arc56 C14.1 arc90 14.92,60.38 ENC2.SW+
N$22
  Top 0.406: ENC1.SW+ 20,96.04 arc90 E1S.1
  Bottom 0.406: C9.1 arc90 20,102.97 ENC1.SW+
N$23
  Top 0.406: PD5.1 arc-90 34.61,75.72 34.61,70.93 arc90 U4.11
N$24  (via drill 0.6)
  Top 0.406: v32.23,60.17 arc-90 30.16,62.23 PB1.1
  Bottom 0.406: U4.15 41.29,60.17 v32.23,60.17
N$25
  Bottom 0.406: XTAL.2 arc-129 40.8,75.09 U4.9 C17.2
N$26
  Bottom 0.406: XTAL.1 arc100 38.42,70.17 U4.10 C18.1
N$27
  Top 0.406: PD4.1 32.38,81.12 arc75 37.47,81.28 arc-44 U4.6
N$28
  Top 0.406: PD7.1 arc-90 32.7,72.55 32.7,66.61 arc90 U4.13
N$29
  Top 0.406: PD6.1 arc-90 33.66,74.14 33.66,68.77 arc90 U4.12
N$30
  Top 0.406: PB0.1 arc-90 31.91,70.8 31.91,64.29 arc90 U4.14
N$31
  Top 0.406: U4.4 36.83,88.58 arc47 33.34,88.74 arc-9 PD2.1
N$32
  Top 0.406: D19.1 5.82,104.93 arc-90 R3.2
N$33
  Top 0.406: U4.5 38.26,86.2 arc8 37.15,87.31 arc29 35.88,87.95 arc25 33.81,87.95 arc22 32.7,87.47 arc29 31.59,86.2 arc-60 PD3.1
N$34
  Bottom 0.813: POWER.1 POWER.2 37.09,6.83 arc-90 R20.1
N$35
  pour Top (isolate 0.432): 3.33,105.89 25.72,105.89 arc-90 27.15,104.46 27.15,1.59 arc-90 25.72,0.16 1.59,0.16 arc-90 0.16,1.59 0.16,104.46 arc-90 1.59,105.89
N$36
  Bottom 0.406: R8.1 Q1.1
N$37
  Bottom 0.406: R9.1 Q2.1
N$38
  Bottom 0.406: Q1.3 15.08,41.59 arc-90 17.62,39.05 arc90 20.64,36.04 22.54,36.04 arc90 26.67,40.16 26.67,69.06 arc90 CLK.1
N$39
  Bottom 0.406: Q2.3 arc90 25.72,43.67 25.72,58.1 arc55 23.65,62.23 arc-51 21.59,66.04 arc-71 RST.1
N$40
  Bottom 0.406: CLOCK.P$3 11.61,38.18 arc-90 R8.2
N$41
  Bottom 0.406: RESET.P$3 21.29,38.18 arc-90 R9.2
N$42
  Top 0.406: CVA.1 7.78,62.39 arc-90 9.05,61.12 9.05,21.51 arc90 CV_A.P$3
N$43
  Top 0.406: R5.1 16.51,62.71 arc81 11.75,69.06 arc63 TRIGA.1
N$44
  Top 0.406: CVB.1 7.14,15.56 arc90 12.06,10.64 22.86,10.64 arc90 26.51,14.29 26.51,15.4 arc90 23.65,18.26 22.62,18.26 arc90 CV_B.P$3
N$45
  Top 0.406: R5.2 16.51,18.65 arc-90 TRIG_A.P$3
N$46
  Bottom 0.406: U4.23 47.3,79.86 arc-90 50.8,76.36 50.8,74.61 arc-90 PC0.1
N$47
  Top 0.406: D19.4 D20.1
N$48
  Top 0.406: R4.2 14.61,36.51 arc-90 RED.A
N$49
  Top 0.406: R7.2 20.32,36.51 arc90 BLUE.A
N$50
  Top 0.406: LEDB.1 10.16,72.55 arc-90 22.07,60.64 arc-29 R7.1
N$51
  Top 0.406: LEDA.1 8.41,63.98 arc-43 R4.1
N$52
  Bottom 0.406: U4.24 arc-90 51.75,77.83 51.75,73.03 arc-90 PC1.1
N$53
  Bottom 0.406: U4.25 arc-90 52.7,79.99 52.7,71.44 arc-90 PC2.1
N$54
  Bottom 0.406: U4.26 arc-90 53.66,82.15 53.66,69.85 arc-90 PC3.1
N$55
  Bottom 0.813: POWER.9 POWER.10 47.36,6.83 arc90 R19.1
N$56
  Bottom 0.406: EXP1.2 EXP1.4 65.56,101.12 arc-90 66.36,100.33 66.36,36.35 | 66.36,36.35 66.36,29.53 | 66.36,29.53 66.36,7.49 arc-90 EXP_JACK_1.P$1 | EXP_JACK_2.P$1 66.33,29.5 arc90 66.36,29.53 | EXP_JACK_3.P$1 66.17,36.54 arc-90 66.36,36.35
  pour Bottom (isolate 0.432): 58.9,105.89 65.41,105.89 arc-90 66.83,104.46 66.83,1.59 arc-90 65.41,0.16 58.74,0.16 arc-90 57.31,1.59 57.31,104.46 arc-90 58.74,105.89
N$57
  Top 0.406: U4.3 35.56,90.17 arc16 PD1.1
N$58
  Top 0.406: D20.4 D21.1
N$59
  Top 0.406: R23.1 58.58,97.63 arc-90 EXP1.5
N$60
  Top 0.406: CV(A).1 arc-90 51.91,59.21 R2.2
N$61
  Top 0.406: CV(B).1 arc-90 49.85,58.74 R1.2
N$62
  Top 0.406: EXP1.3 R22.1
N$63
  Top 0.406: R21.1 65.56,97.63 arc90 EXP1.1
N$64
  Top 0.406: R3.1 20.32,91.28 arc20 22.86,89.38 arc-4 RGB.1
N$65
  Top 0.406: EXP_JACK_3.P$3 R22.2
N$66
  Top 0.406: D21.4 D22.1
N$67
  Top 0.406: R6.1 18.41,61.91 arc90 10.16,70.17 arc6 TRIGB.1
N$68
  Top 0.406: D22.4 D23.1
N$69
  Top 0.406: R6.2 18.41,18.65 arc90 TRIG_B.P$3
N$70
  Top 0.406: D23.4 D13.1
N$71
  Top 0.406: D14.1 D13.4
N$72
  Top 0.406: D14.4 D15.1
N$73
  Top 0.406: D2.1 D1.4
N$74
  Top 0.406: D2.4 D3.1
N$75
  Top 0.406: D4.1 D3.4
N$76
  Top 0.406: D5.1 D4.4
N$77
  Top 0.406: D6.1 D5.4
N$78
  Top 0.406: D7.1 D6.4
N$79
  Top 0.406: D8.1 D7.4
N$80
  Top 0.406: D1.1 D15.4
N$81
  Top 0.406: R23.2 58.58,21.67 arc90 EXP_JACK_2.P$3
N$82
  Top 0.406: R21.2 65.56,18.02 arc-90 EXP_JACK_1.P$3
PC4
  Top 0.406: U4.27 arc-90 47.62,91.3 47.62,93.66 arc-40 49.05,97.63 arc47 EXP.3
PC5
  Top 0.406: EXP.5 52.52,94.75 arc-90 U4.28
PD0
  Top 0.406: EXP.1 42.42,100.84 arc90 39.85,98.27 39.85,93.69 arc90 U4.2
PE  (via drill 0.6)
  Top 0.406: U4.22 48.82,77.41 arc90 C23.2
  Top 0.61: v30.16,45.56 29.37,45.56 29.37,21.91 arc90 38.42,12.86 arc-90 42.23,9.05 POWER.6 POWER.8
  Top 0.813: POWER.8 POWER.7 POWER.5 | POWER.5 POWER.3 POWER.4 POWER.6 POWER.5
  Bottom 0.305: U4.22 arc-90 44.61,78.76 arc144 40.8,80.01 arc29 40.64,79.61 arc-31 39.61,77.15 arc-88 U4.8
  Bottom 0.406: R11.1 arc90 49.9,48.1 47.47,48.1 | C19.2 arc90 47.47,45.66 47.47,48.1 | C18.2 32.23,74.4 32.23,74.3 | C17.1 32.23,77.15 | U4.8 37.15,77.47 35.65,77.86 | 35.65,77.86 32.23,78.74 | 47.47,48.1 47.47,49.85 arc90 46.04,51.28 44.77,51.28 arc90 43.5,50.01 IC3.7 43.5,47.94 arc-90 42.39,46.83 38.89,46.83 | C20.2 arc-90 33.28,46.83 38.58,46.83 | 38.58,46.83 38.89,46.83 | R12.1 38.79,46.73 arc-90 38.89,46.83 | IC3.5 38.42,46.99 arc90 38.58,46.83 | C16.2 35.65,77.86
  Bottom 0.61: 29.37,55.09 29.37,59.53 arc-30 30.96,64.45 arc33 32.23,68.74 32.23,74.3 32.23,77.15 32.23,78.74 32.23,90.81 arc90 GND..1 30.16,100.63 arc-90 C15.- arc-90 33.35,103.82 41.92,103.82 arc-90 IC4.1 47.02,102.96 arc90 EXP.2 EXP.4 | 29.37,55.09 29.37,45.56 v30.16,45.56 C20.2 | J1.6 29.37,55.09 | C21.- arc90 49.03,12.06 42.23,12.06
  Bottom 0.813: POWER.6 POWER.8 POWER.7 POWER.3 | POWER.6 POWER.4 POWER.3 | POWER.3 POWER.5 POWER.6 | 42.23,11.89 POWER.6
  Bottom 1.016: C22.+ 42.23,11.89
  Bottom 1.27: C22.+ C21.-
  pour Bottom (isolate 0.432): 30.8,105.89 54.29,105.89 arc-90 55.72,104.46 55.72,1.59 arc-90 54.29,0.16 30.16,0.16 arc-90 28.73,1.59 28.73,104.46 arc-90 30.16,105.89
  pour Top (isolate 0.432): 31.91,105.89 54.29,105.89 arc-90 55.72,104.46 55.72,1.59 arc-90 54.29,0.16 30.16,0.16 arc-90 28.73,1.59 28.73,104.46 arc-90 30.16,105.89
RESET
  Top 0.406: U4.1 arc-88 44.45,90.65 35.72,58.42 arc-21 J1.5
  Bottom 0.406: R10.1 42.19,94.46 arc-90 U4.1
SCK
  Top 0.406: U4.19 arc-90 46.67,67.36 46.67,59.85 arc41 47.15,58.58 arc-40 47.94,56.52 arc-90 45.72,54.29 43.34,54.29 arc-90 IC3.3
  Bottom 0.406: IC3.3 arc-90 37.15,52.55 J1.3
SS
  Bottom 0.406: U4.16 arc-90 43.5,61.2 IC3.2
(copper drawn outside any net)
  shapes: Bottom circle x4, Top circle x8

### Text on the board
tNames: PRIZMA | v1.0 | Sz. M. | 2016 | BLUE | RED | V/OCT | V/OCT | ZERO | ZERO | RED STRIPE!
bStop: EXPANDER